# Altium schematic sheet FSM.SchDoc
size A4; SheetNumber: 2; SheetTotal: 5
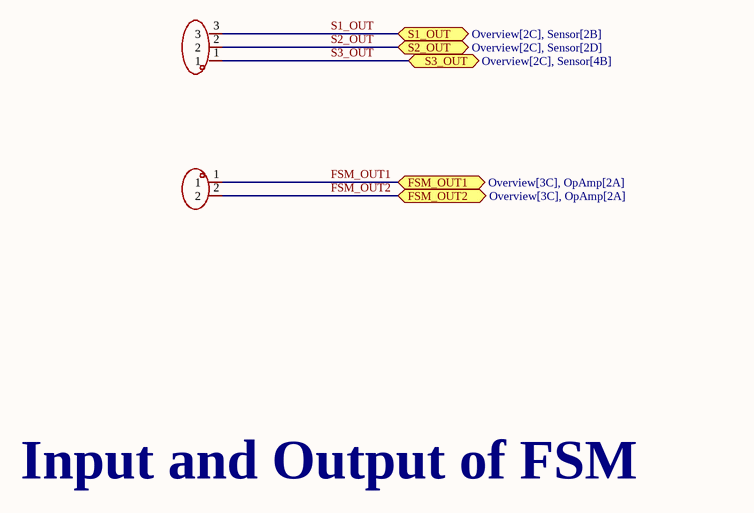
[diagram p0: FSM.SchDoc]

## Parts
H1  HX PZ2.54-1x3P ZZ  [CONN-TH_HX-PZ2.54-1X3P-ZZ]  (value not drawn)
U4  HX PZ2.54-1x2P ZZ  [HDR-TH_2P-P2.54-V-M-3]  (value not drawn)

## Ports
FSM_OUT1 (bidir, see Overview[3C], OpAmp[2A]), FSM_OUT2 (bidir, see Overview[3C], OpAmp[2A]), S1_OUT (bidir, see Overview[2C], Sensor[2B]), S2_OUT (bidir, see Overview[2C], Sensor[2D]), S3_OUT (bidir, see Overview[2C], Sensor[4B])

## Nets
FSM_OUT1: U4.1 ; port FSM_OUT1
FSM_OUT2: U4.2 ; port FSM_OUT2
S1_OUT: H1.3 ; port S1_OUT
S2_OUT: H1.2 ; port S2_OUT
S3_OUT: H1.1 ; port S3_OUT

## Notes on the sheet
- Input and Output of FSM

## Library data of the parts
H1 = HX PZ2.54-1x3P ZZ: 3P 1x3P Gold Brass -40℃~+105℃ Black Pin Header 2.54mm 2.5mm 6mm 1kV 3mm 3A 1 Through Hole Through Hole,P=2.54mm Headers, Male Pins ROHS; Manufacturer: hanxia(韩下); Add into BOM: yes; Symbol: HX PZ2.54-1X3P ZZ; Device: HX PZ2.54-1x3P ZZ; LCSC Part Name: 1x3P 间距:2.54mm 方针 直插; Supplier Part: C32713269; Manufacturer Part: HX PZ2.54-1x3P ZZ; Supplier Footprint: 插件,P=2.54mm; JLCPCB Part Class: Extended Part; Datasheet: https://item.szlcsc.com/datasheet/HX%2520PZ2.54-1x3P%2520ZZ/34444549.html; Supplier: LCSC; Convert to PCB: yes; Pin Structure: 1x3P; Pitch: 2.54mm; Row Spacing: -; Circluar Pins/Square Pins: Pin Header; Mounting Type: Through Hole; Number of Rows: 1; Number of Pins: 3P; Current Rating: 3A; Voltage Rating (Max): 1kV; Length of Mating Pin: 6mm; Insulation Height: 2.5mm; Length of End Connection Pin: 3mm; Contact Material: Brass; Contact Plating: Gold; Operating Temperature: -40℃~+105℃; Color: Black; Supplementary Features: -
U4 = HX PZ2.54-1x2P ZZ: Manufacturer: hanxia(韩下); Add into BOM: yes; Pin Structure: 1x2P; Pitch: 2.54mm; Circluar Pins/Square Pins: Pin Header; Current Rating: 3A; Symbol: HX PZ2.54-1X2P ZZ; Device: HX PZ2.54-1x2P ZZ; LCSC Part Name: 1x2P 间距:2.54mm 方针 直插; Supplier Part: C32713268; Manufacturer Part: HX PZ2.54-1x2P ZZ; Supplier Footprint: 插件,P=2.54mm; JLCPCB Part Class: Extended Part; Datasheet: https://item.szlcsc.com/datasheet/HX%2520PZ2.54-1x2P%2520ZZ/34444548.html; Supplier: LCSC; Convert to PCB: yes; Row Spacing: -; Mounting Type: Through Hole; Number of Rows: 1; Number of Pins: 2P; Voltage Rating (Max): -; Length of Mating Pin: 6mm; Insulation Height: 2.5mm; Length of End Connection Pin: 3mm; Contact Material: Brass; Contact Plating: Gold; Operating Temperature: -40℃~+105℃; Color: Black